# Altium schematic sheet Power.SchDoc
size B
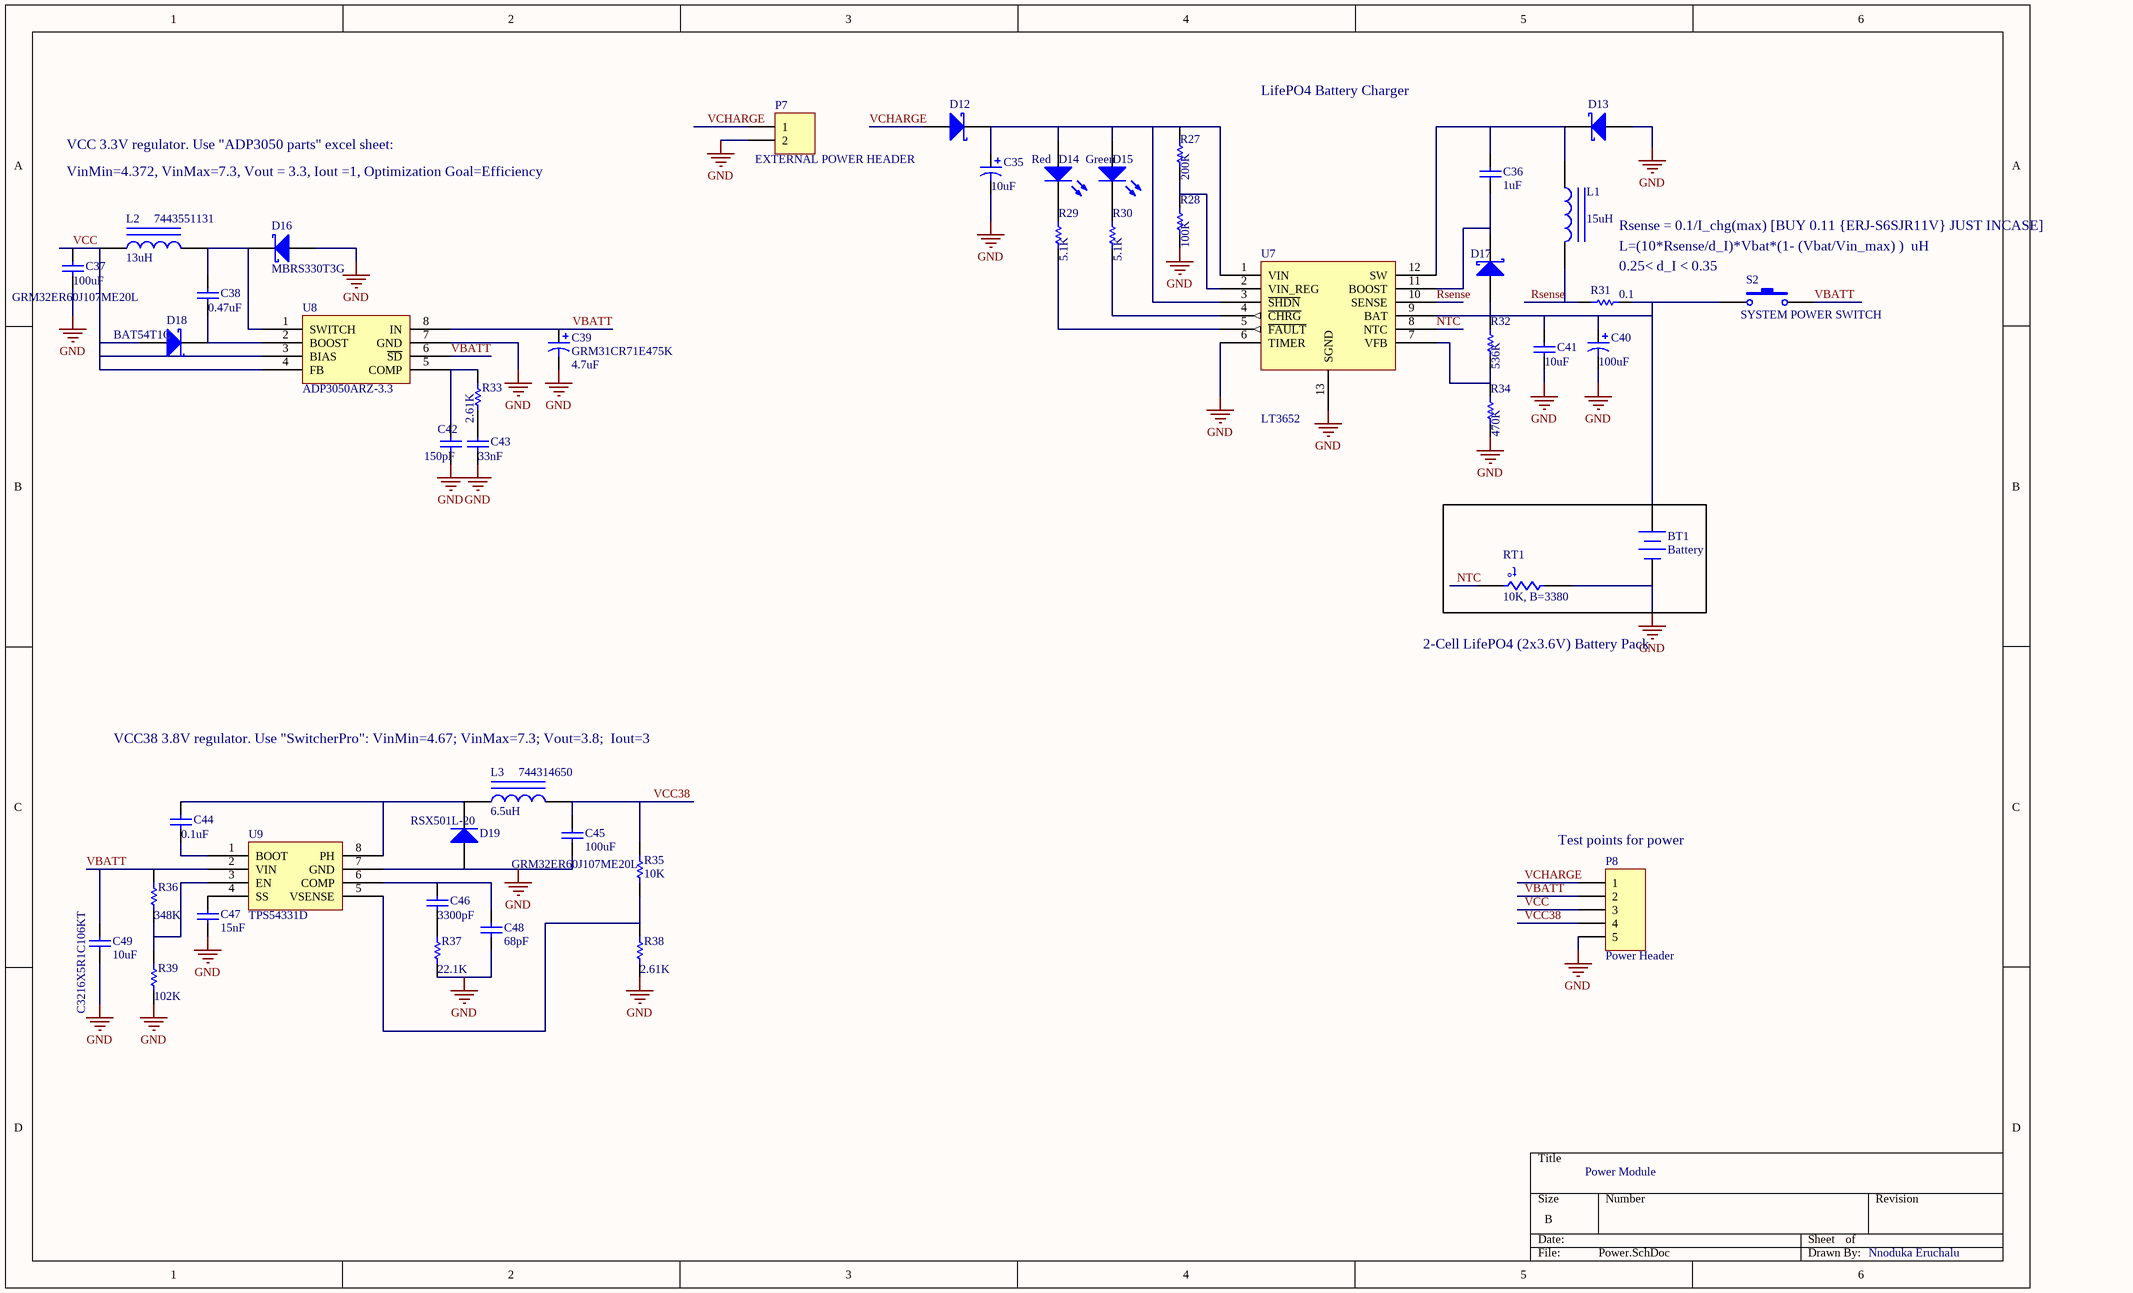
[diagram p0: Power.SchDoc]

## Parts
BT1  Battery  [JST PH]
C35  value 10uF  [TC7343-2917]  (hidden comment: TR3D106K035C0125)
C36  value 1uF  [2012[0805]]  (hidden comment: C2012Y5V1H105Z/0.85)
C37  GRM32ER60J107ME20L  value 100uF  [3225[1210]]
C38  value 0.47uF  [2012[0805]]  (hidden comment: CGJ4J2X7R0J474K)
C39  GRM31CR71E475K  value 4.7uF  [3216[1206]]
C40  value 100uF  [TC7343-2917]  (hidden comment: T495D107K010ZTE100)
C41  value 10uF  [2012[0805]]  (hidden comment: GRM21BR71A106KE51L)
C42  value 150pF  [2012[0805]]  (hidden comment: C0805C151J5GACTU)
C43  value 33nF  [2012[0805]]  (hidden comment: C0805C333J3RACTU)
C44  value 0.1uF  [2012[0805]]  (hidden comment: C2012X7R1H104K/0.85)
C45  GRM32ER60J107ME20L  value 100uF  [3225[1210]]
C46  value 3300pF  [2012[0805]]  (hidden comment: C2012C0G1H332J/1.25)
C47  value 15nF  [2012[0805]]  (hidden comment: C2012C0G1H153J)
C48  value 68pF  [2012[0805]]  (hidden comment: C0805C680J5GACTU)
C49  C3216X5R1C106KT  value 10uF  [3216[1206]]
D12  CDBA340L-G  [SMA DO-214AC]  (value not drawn)
D13  CDBA340L-G  [SMA DO-214AC]  (value not drawn)
D14  value Red  [LTST-C17X]  (hidden comment: LTST-C170KRKT)
D15  value Green  [LTST-C17X]  (hidden comment: LTST-C171GKT)
D16  MBRS330T3G  [SMC DO-214AB]
D17  CDBA340L-G  [SMA DO-214AC]  (value not drawn)
D18  BAT54T1G  [SOD123]
D19  RSX501L-20  [RSX501L-20]
L1  value 15uH  [SLF7055]  (hidden comment: SLF7055T-150M2R1-3PF)
L2  7443551131  value 13uH  [7443551131]
L3  744314650  value 6.5uH  [744314650]
P7  EXTERNAL POWER HEADER  [JST PH]
P8  Power Header  [HDR1X5]
R27  value 200K  [2012[0805]]  (hidden comment: ERJ-6GEYJ204V)
R28  value 100K  [2012[0805]]  (hidden comment: ERJ-6GEYJ104V)
R29  value 5.1K  [2012[0805]]  (hidden comment: ERJ-6GEYJ512V)
R30  value 5.1K  [2012[0805]]  (hidden comment: ERJ-6GEYJ512V)
R31  value 0.1  [2012[0805]]  (hidden comment: ERJ-L06KF10CV)
R32  value 536K  [2012[0805]]  (hidden comment: ERJ-6ENF5363V)
R33  value 2.61K  [2012[0805]]  (hidden comment: ERJ-6ENF2611V)
R34  value 470K  [2012[0805]]  (hidden comment: ERJ-6GEYJ474V)
R35  value 10K  [2012[0805]]  (hidden comment: ERJ-6ENF1002V)
R36  value 348K  [2012[0805]]  (hidden comment: ERJ-6ENF3483V)
R37  value 22.1K  [2012[0805]]  (hidden comment: ERJ-6ENF2212V)
R38  value 2.61K  [2012[0805]]  (hidden comment: ERJ-6ENF2611V)
R39  value 102K  [2012[0805]]  (hidden comment: ERJ-6ENF1023V)
RT1  value 10K, B=3380  [1608[0603]]  (hidden comment: NCP18XH103F03RB)
S2  SYSTEM POWER SWITCH  [JST PH]
U7  LT3652  [LT3652MSE]
U8  ADP3050ARZ-3.3  [SOIC127P600-8N]
U9  TPS54331D  [SOIC127P600-8N]

## Nets
GND: BT1.2(-) C35.2 C37.1 C39.2 C40.2 C41.1 C42.1 C43.1 C45.1 C47.1 C48.1 C49.1 D13.1(A) D16.1(A) D19.1(A) P7.2 P8.5 R28.2 R34.2 R37.2 R38.2 R39.2 RT1.2 U7.6(TIMER) U7.13(SGND) U8.7(GND) U9.7(GND)
NTC: RT1.1 U7.8(NTC)
Rsense: L1.2 R31.2 U7.10(SENSE)
VBATT: C39.1 C49.2 P8.2 R36.1 S2.2 U8.6(~{SD}) U8.8(IN) U9.2(VIN)
VCC: C37.2 D18.1(A) L2.1 P8.3 U8.3(BIAS) U8.4(FB)
VCC38: C45.2 L3.2 P8.4 R35.1
VCHARGE: D12.1(A) P7.1 P8.1
NetBT1_1: BT1.1(+) C40.1 C41.2 D17.1(A) R31.1 R32.1 S2.1 U7.9(BAT)
NetC35_1: C35.1 D12.2(K) D14.1(A) D15.1(A) R27.1 U7.1(VIN) U7.3(~{SHDN})
NetC36_1: C36.1 D17.2(K) U7.11(BOOST)
NetC36_2: C36.2 D13.2(K) L1.1 U7.12(SW)
NetC38_1: C38.1 D18.2(K) U8.2(BOOST)
NetC38_2: C38.2 D16.2(K) L2.2 U8.1(SWITCH)
NetC42_2: C42.2 R33.1 U8.5(COMP)
NetC43_2: C43.2 R33.2
NetC44_1: C44.1 U9.1(BOOT)
NetC44_2: C44.2 D19.2(K) L3.1 U9.8(PH)
NetC46_1: C46.1 R37.1
NetC46_2: C46.2 C48.2 U9.6(COMP)
NetC47_2: C47.2 U9.4(SS)
NetD14_2: D14.2(K) R29.1
NetD15_2: D15.2(K) R30.1
NetR27_2: R27.2 R28.1 U7.2(VIN_REG)
NetR29_2: R29.2 U7.5(~{FAULT})
NetR30_2: R30.2 U7.4(~{CHRG})
NetR32_2: R32.2 R34.1 U7.7(VFB)
NetR35_2: R35.2 R38.1 U9.5(VSENSE)
NetR36_2: R36.2 R39.1 U9.3(EN)

## Notes on the sheet
- LifePO4 Battery Charger
- VCC 3.3V regulator. Use "ADP3050 parts" excel sheet:
- VinMin=4.372, VinMax=7.3, Vout = 3.3, Iout =1, Optimization Goal=Efficiency
- Rsense = 0.1/I_chg(max) [BUY 0.11 {ERJ-S6SJR11V} JUST INCASE]
- L=(10*Rsense/d_I)*Vbat*(1- (Vbat/Vin_max) )  uH
- 0.25< d_I < 0.35
- 2-Cell LifePO4 (2x3.6V) Battery Pack
- VCC38 3.8V regulator. Use "SwitcherPro": VinMin=4.67; VinMax=7.3; Vout=3.8;  Iout=3
- (near P8) Test points for power
- Power Module
- Nnoduka Eruchalu
- (in symbol Res Thermal) t°

## Library data of the parts
BT1 = Battery: Multicell Battery; Published: 24-Mar-1999; LatestRevisionDate: 17-Jul-2002; LatestRevisionNote: Re-released for DXP Platform.; PackageReference: BAT-2; Publisher: Altium Limited
C35 C39 C40 = Cap Pol1: Polarized Capacitor (Radial); Published: 8-Jun-2000; LatestRevisionDate: 17-Jul-2002; LatestRevisionNote: Re-released for DXP Platform.; PackageReference: RB7.6-15; Publisher: Altium Limited
C36-C38 C41-C49 = C0805: Ceramic Chip Capacitor - Standard; Note: Footprint corresponds to dimensions for bulk cassette packaging. This case size has tightened tolerances.; Published: 17-Jul-2002; LatestRevisionDate: 19-Mar-2004; LatestRevisionNote: Silkscreen size reduced.; DatasheetDocument: Mar-2001; PackageDocument: Mar-2001; PackageReference: 0805; Publisher: Altium Limited; Code_JEITA: 0805; Code_IPC: 2012[0805]; ComponentLink1Description: Manufacturer Link; ComponentLink1URL: http://www.kemet.com/; ComponentLink2Description: Datasheet; ComponentLink2URL: http://www.kemet.com/kemet/web/homepage/kechome.nsf/vapubfilesname/F3102TA.pdf/$file/F3102TA.pdf
D12 D13 D16 D17 = 30BQ040: Schottky Rectifier; Published: 8-Jun-2000; LatestRevisionDate: 17-Jul-2002; LatestRevisionNote: Re-released for DXP Platform.; DatasheetDocument: PD-2.439; PackageReference: SMC; Publisher: Altium Limited; Code_JEDEC: DO-214-AB; ComponentLink1Description: Manufacturer Link; ComponentLink1URL: http://www.irf.com/; ComponentLink2Description: Datasheet; ComponentLink2URL: http://www.irf.com/product-info/datasheets/data/30bq040.pdf
D14 D15 = LED2: Typical RED, GREEN, YELLOW, AMBER GaAs LED; Published: 8-Jun-2000; LatestRevisionDate: 17-Jul-2002; LatestRevisionNote: Re-released for DXP Platform.; PackageDocument: Feb-2002; PackageReference: 3.2X1.6X1.1; Publisher: Altium Limited
D18 = Diode 11DQ03: Schottky Rectifier; Published: 8-Jun-2000; LatestRevisionDate: 17-Jul-2002; LatestRevisionNote: Re-released for DXP Platform.; DatasheetDocument: Dec-1997; PackageReference: DO-204AL; Publisher: Altium Limited; Code_JEDEC: DO-204-AL; ComponentLink1Description: Manufacturer Link; ComponentLink1URL: http://www.irf.com/; ComponentLink2Description: Datasheet; ComponentLink2URL: http://www.irf.com/product-info/datasheets/data/11dq03.pdf
D19 = Diode: Default Diode; Published: 8-Jun-2000; LatestRevisionDate: 17-Jul-2002; LatestRevisionNote: Re-released for DXP Platform.; PackageDocument: Sep-1996; PackageReference: SMC; Publisher: Altium Limited; Code_JEDEC: DO-214-AB
L1-L3 = Inductor Iron: Magnetic-Core Inductor; Published: 24-Mar-1999; LatestRevisionDate: 17-Jul-2002; LatestRevisionNote: Re-released for DXP Platform.; PackageReference: AXIAL-0.9; Publisher: Altium Limited
P7 = Header 2: Header, 2-Pin; LatestRevisionDate: 17-Jul-2002; LatestRevisionNote: Re-released for DXP Platform.; Publisher: Altium Limited
P8 = Header 5: Header, 5-Pin; LatestRevisionDate: 17-Jul-2002; LatestRevisionNote: Re-released for DXP Platform.; Publisher: Altium Limited
R27-R39 = Res1: Resistor; Published: 8-Jun-2000; LatestRevisionDate: 17-Jul-2002; LatestRevisionNote: Re-released for DXP Platform.; PackageReference: AXIAL-0.3; Publisher: Altium Limited
RT1 = Res Thermal: Thermistor; Published: 24-Mar-1999; LatestRevisionDate: 04-Mar-2005; LatestRevisionNote: PCB Footprint replaced.; PackageReference: 6-0805; Publisher: Altium Limited
S2 = SW-PB: Switch; Published: 24-Mar-1999; LatestRevisionDate: 17-Jul-2002; LatestRevisionNote: Re-released for DXP Platform.; PackageReference: SPST-2; Publisher: Altium Limited